# Altium project IMX385_Final.PrjPcb
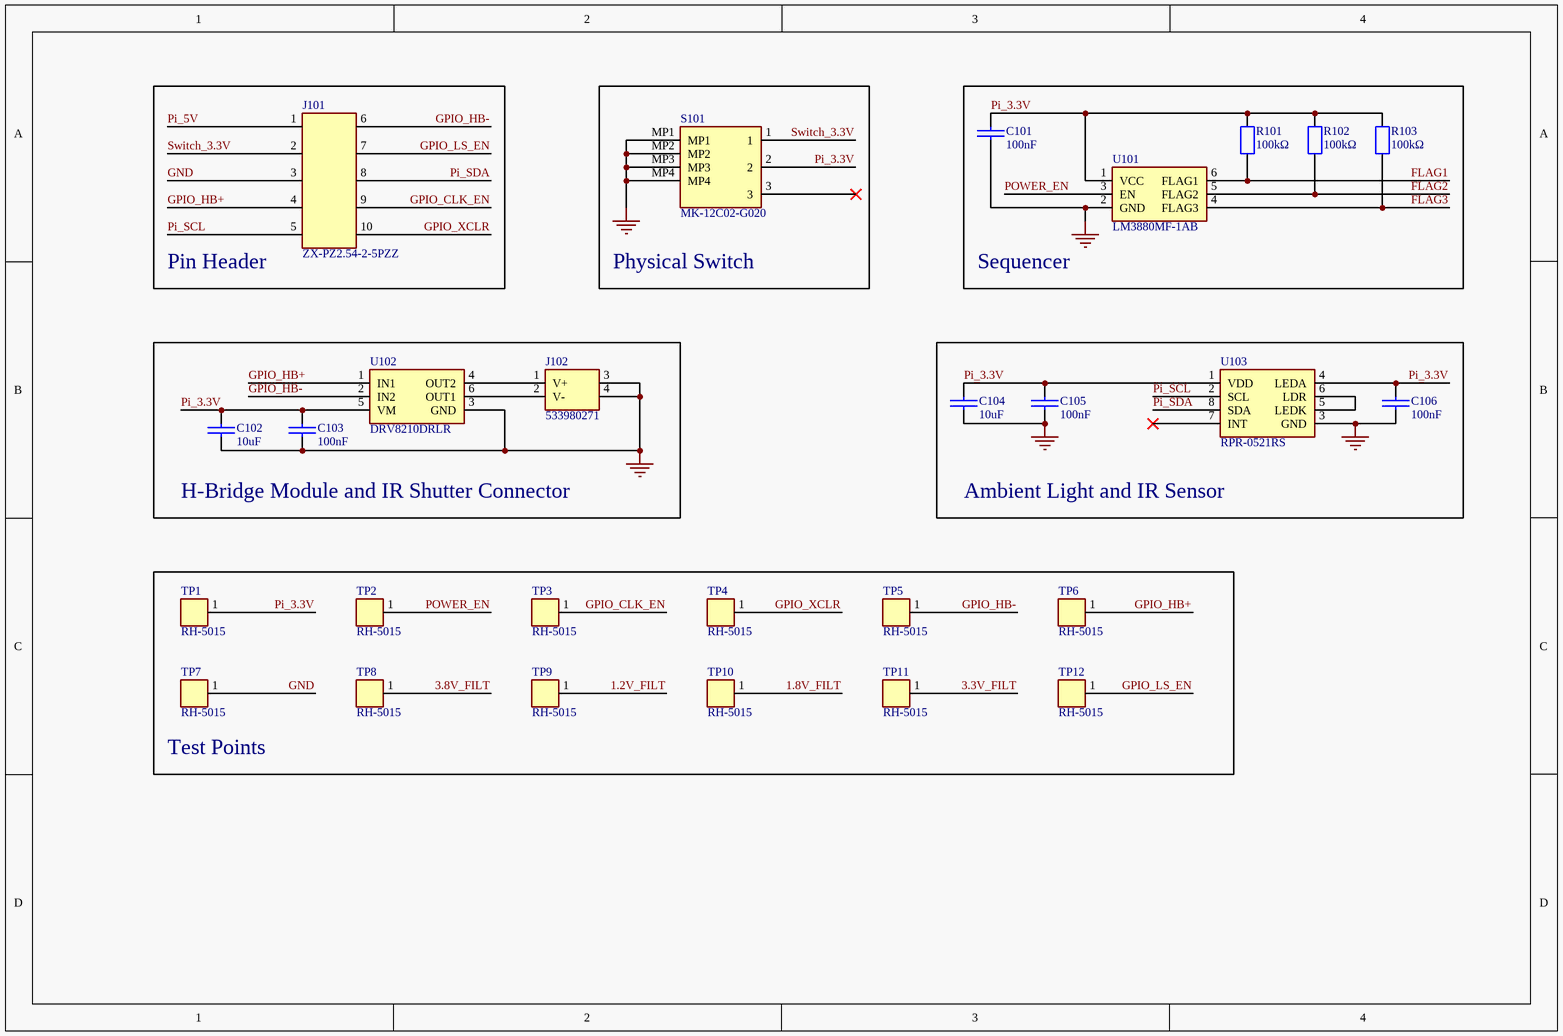
[diagram p0: IMX_Supporting Circuits.SchDoc]
8 sheets, 125 parts. Net scope: global (net labels, ports and power ports of the same name join across sheets).
Board file: IMX_PCB.PcbDoc
Sheets:
  IMX_Supporting Circuits.SchDoc
  IMX_Power Regulation.SchDoc
  IMX_1.2V Digital Power Supply.SchDoc
  IMX_1.8 V Interface Power Supply.SchDoc
  IMX_3.3 V Analog Power Supply.SchDoc
  IMX_Digital Interface Circuit.SchDoc
  IMX_Analog Interface Circuit.SchDoc
  IMX_Output Circuit.SchDoc

## Sheet IMX_Supporting Circuits.SchDoc
size A4; SheetNumber: 1; SheetTotal: 8

### Parts
C101  100nF  [Capacitor, 0402]
C102  10uF  [Capacitor, 0603]
C103  100nF  [Capacitor, 0402]
C104  10uF  [Capacitor, 0603]
C105  100nF  [Capacitor, 0402]
C106  100nF  [Capacitor, 0402]
J101  ZX-PZ2.54-2-5PZZ  [Pin Header, DIP 2x5, 2.54mm]
J102  533980271  [Molex PicoBlade, Wire To Board 1x2, 533980271]
R101  100kΩ  [Resistor, 0603, Yageo]
R102  100kΩ  [Resistor, 0603, Yageo]
R103  100kΩ  [Resistor, 0603, Yageo]
S101  MK-12C02-G020  [Swich, 1A, Single Pole Double Throw, MK-12C02-G020]
TP1  RH-5015  [Test Point]
TP2  RH-5015  [Test Point]
TP3  RH-5015  [Test Point]
TP4  RH-5015  [Test Point]
TP5  RH-5015  [Test Point]
TP6  RH-5015  [Test Point]
TP7  RH-5015  [Test Point]
TP8  RH-5015  [Test Point]
TP9  RH-5015  [Test Point]
TP10  RH-5015  [Test Point]
TP11  RH-5015  [Test Point]
TP12  RH-5015  [Test Point]
U101  LM3880MF-1AB  [Sequencer, SOT-23]
U102  DRV8210DRLR  [H-Bridge, SOT-563]
U103  RPR-0521RS  [Rohm ALS]

### Blocks framed on the sheet
Pin Header: J101
Physical Switch: S101
Sequencer: C101 R101-R103 U101
H-Bridge Module and IR Shutter Connector: C102 C103 J102 U102
Ambient Light and IR Sensor: C104-C106 U103
Test Points: TP1-TP12

### Nets
1.2V_FILT: TP9.1
1.8V_FILT: TP10.1
3.3V_FILT: TP11.1
GND: C101.2 C102.2 C103.2 C104.2 C105.2 C106.2 J101.3 J102.3 J102.4 S101.MP1 S101.MP2 S101.MP3 S101.MP4 TP7.1 U101.2(GND) U102.3(GND) U103.3(GND)
3.8V_FILT: TP8.1
FLAG1: R101.1 U101.6(FLAG1)
FLAG2: R102.1 U101.5(FLAG2)
FLAG3: R103.1 U101.4(FLAG3)
GPIO_CLK_EN: J101.9 TP3.1
GPIO_HB+: J101.4 TP6.1 U102.1(IN1)
GPIO_HB-: J101.6 TP5.1 U102.2(IN2)
GPIO_LS_EN: J101.7 TP12.1
GPIO_XCLR: J101.10 TP4.1
Pi_3.3V: C101.1 C102.1 C103.1 C104.1 C105.1 C106.1 R101.2 R102.2 R103.2 S101.2 TP1.1 U101.1(VCC) U102.5(VM) U103.1(VDD) U103.4(LEDA)
Pi_5V: J101.1
Pi_SCL: J101.5 U103.2(SCL)
Pi_SDA: J101.8 U103.8(SDA)
POWER_EN: TP2.1 U101.3(EN)
Switch_3.3V: J101.2 S101.1
NetJ102_1: J102.1(V+) U102.4(OUT2)
NetJ102_2: J102.2(V-) U102.6(OUT1)
NetU103_5: U103.5(LEDK) U103.6(LDR)

Not connected (* = marked no-connect by the designer): S101 3*; U103 7(INT)*

### Library data of the parts
C101 C103 C105 C106 = Capacitor, 0402, 100nF: Ceramic Capacitor, 16V, 10% +/- Tol, X7R, 0.1uF, SMD, 0402, #CL05B104KO5NNNC, JLC#C1525; Capacitance: 100nF
C102 C104 = Capacitor, 0603, 10uF: Ceramic Capacitor, 10V, 10% +/- Tol, X7R, 10uF, SMD, 0603, #GRM188Z71A106KA73D, JLC#C2959727; Capacitance: 10uF
J101 = Pin Header, DIP 2x5, 2.54mm: Gold 1kV 3A Direct Insert Policy 2.5mm 10P 6mm -40℃~+105℃ 3mm 2.54mm Brass Double Row Black 2.54mm 2x5P Plugin,P=2.54mm Pin Headers ROHS. #ZX-PZ2.54-2-5PZZ, #C7501276
J102 = Molex PicoBlade, Wire To Board 1x2: 1x2P 2P PicoBlade(MX 1.25) Tin 2 -40℃~+105℃ 1A 1 1.25mm Phosphor Bronze Standing paste SMD,P=1.25mm Wire To Board Connector ROHS, #533980271, JLC#C122410
R101-R103 = Resistor, 0603, 100kΩ: Thick Film Resistor, ±1%, ±100ppm/℃, -55℃~+155℃, 0603, 100kΩ, #RC0603FR-07100KL, JLC#C14675
S101 = Swich, 1A, Single Pole Double Throw: Horizontal attachment 1A Single Pole Double Throw (SPDT) 6V Black 10,000 times SMD Slide Switches ROHS, JLC#C963206
TP1-TP12 = Test Ring: Pogo Pin Spring Probe Connector ROHS, #RH-5015, JLC#C5199798
U101 = Sequencer, 3 Flags, 30ms, 1-2-3/3-2-1: USON-6-EP(2.1x2.1) Ambient Light Sensors ROHS, JLC#C701867; Manufacturer_Name: Texas Instruments; Manufacturer_Part_Number: LM3880MF-1AB/NOPB; Datasheet Link: http://www.ti.com/lit/gpn/lm3880; Height: 1.45mm; Mouser Part Number: 926-LM3880MF1ABNOPB; Mouser Price/Stock: https://www.mouser.co.uk/ProductDetail/Texas-Instruments/LM3880MF-1AB-NOPB?qs=QbsRYf82W3EUDzy5l%252BzEeQ%3D%3D; Arrow Part Number: LM3880MF-1AB/NOPB; Arrow Price/Stock: https://www.arrow.com/en/products/lm3880mf-1abnopb/texas-instruments?region=nac
U102 = H-Bridge, SOT-563: SOT-563 Relay / Coil Drivers ROHS, #DRV8210DRLR, JLC#C3681297
U103 = Rohm ALS: SMD-8P Ambient Light Sensors ROHS, JLC#C509781

## Sheet IMX_Power Regulation.SchDoc
size A4; SheetNumber: 2; SheetTotal: 8
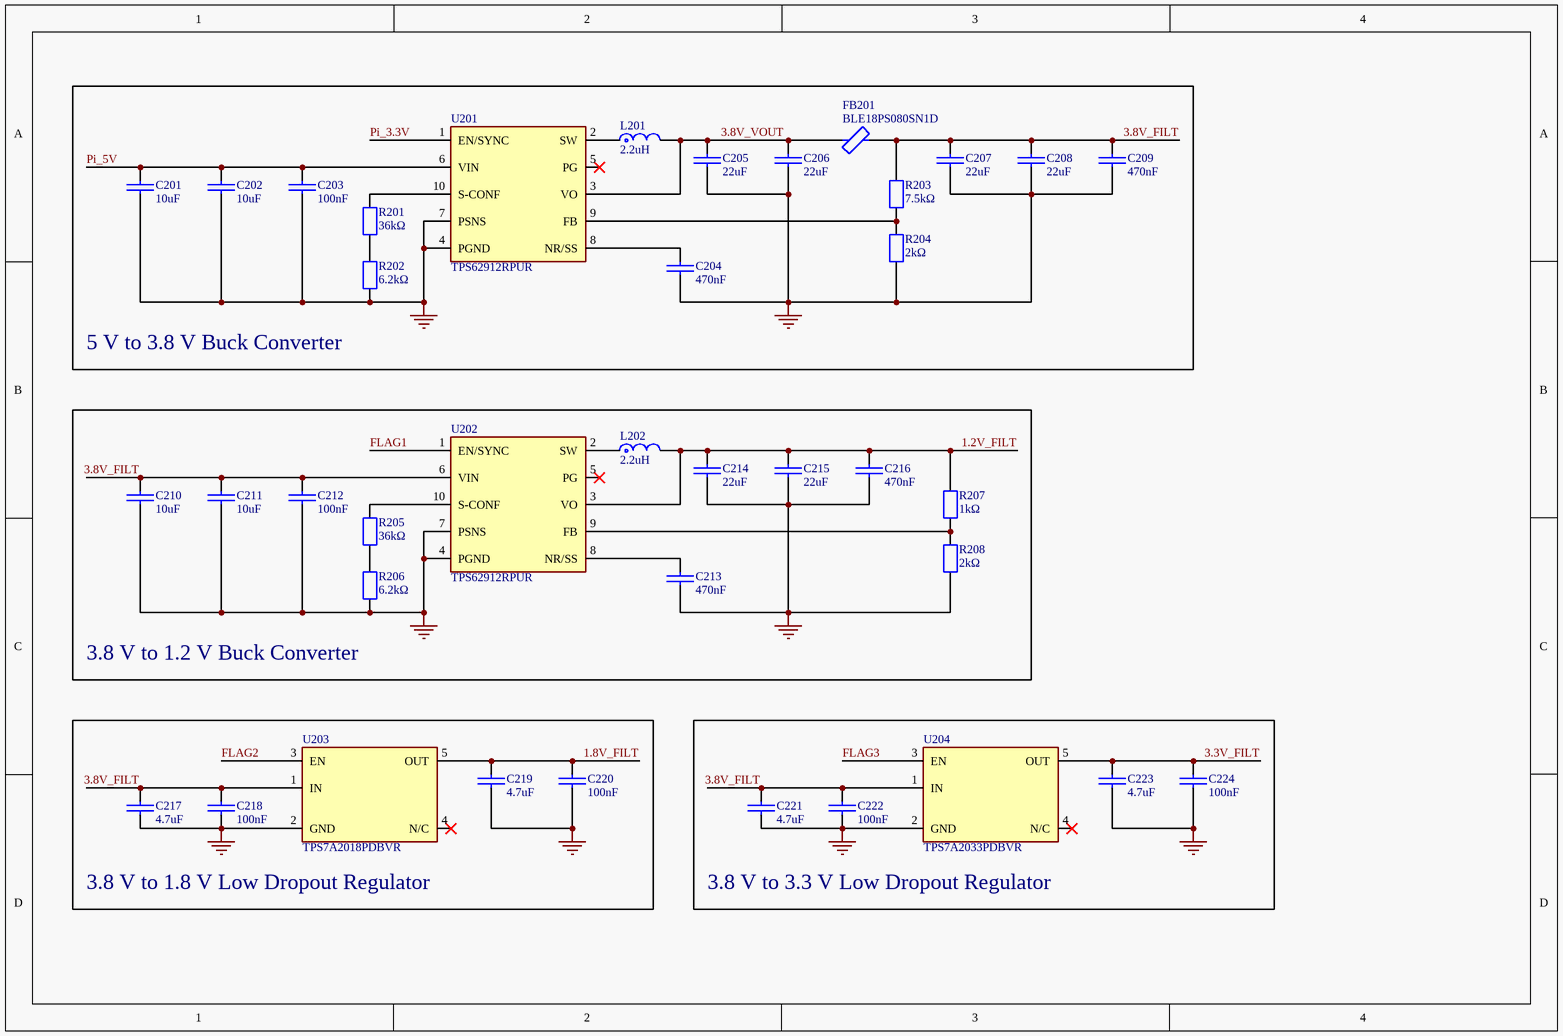
[diagram p1: IMX_Power Regulation.SchDoc]

### Parts
C201  10uF  [Capacitor, 0603]
C202  10uF  [Capacitor, 0603]
C203  100nF  [Capacitor, 0402]
C204  470nF  [Capacitor, 0402]
C205  22uF  [Capacitor, 0805]
C206  22uF  [Capacitor, 0805]
C207  22uF  [Capacitor, 0805]
C208  22uF  [Capacitor, 0805]
C209  470nF  [Capacitor, 0402]
C210  10uF  [Capacitor, 0603]
C211  10uF  [Capacitor, 0603]
C212  100nF  [Capacitor, 0402]
C213  470nF  [Capacitor, 0402]
C214  22uF  [Capacitor, 0805]
C215  22uF  [Capacitor, 0805]
C216  470nF  [Capacitor, 0402]
C217  4.7uF  [Capacitor, 0603]
C218  100nF  [Capacitor, 0402]
C219  4.7uF  [Capacitor, 0603]
C220  100nF  [Capacitor, 0402]
C221  4.7uF  [Capacitor, 0603]
C222  100nF  [Capacitor, 0402]
C223  4.7uF  [Capacitor, 0603]
C224  100nF  [Capacitor, 0402]
FB201  BLE18PS080SN1D  [Ferrite Bead, 0603]
L201  2.2uH  [Inductor, 1616]
L202  2.2uH  [Inductor, 1616]
R201  36kΩ  [Resistor, 0603, Yageo]
R202  6.2kΩ  [Resistor, 0603, Yageo]
R203  7.5kΩ  [Resistor, 0603, Yageo]
R204  2kΩ  [Resistor, 0603, Yageo]
R205  36kΩ  [Resistor, 0603, Yageo]
R206  6.2kΩ  [Resistor, 0603, Yageo]
R207  1kΩ  [Resistor, 0603, Yageo]
R208  2kΩ  [Resistor, 0603, Yageo]
U201  TPS62912RPUR  [Buck Converter, TPS62912RPUR]
U202  TPS62912RPUR  [Buck Converter, TPS62912RPUR]
U203  TPS7A2018PDBVR  [TPS7A20 - SOT-23-5L]
U204  TPS7A2033PDBVR  [TPS7A20 - SOT-23-5L]

### Blocks framed on the sheet
5 V to 3.8 V Buck Converter: C201-C209 FB201 L201 R201-R204 U201
3.8 V to 1.2 V Buck Converter: C210-C216 L202 R205-R208 U202
3.8 V to 1.8 V Low Dropout Regulator: C217-C220 U203
3.8 V to 3.3 V Low Dropout Regulator: C221-C224 U204

### Nets
1.2V_FILT: C214.1 C215.1 C216.1 L202.2 R207.2 U202.3(VO)
1.8V_FILT: C219.1 C220.1 U203.5(OUT)
3.3V_FILT: C223.1 C224.1 U204.5(OUT)
GND: C201.2 C202.2 C203.2 C204.2 C205.2 C206.2 C207.2 C208.2 C209.2 C210.2 C211.2 C212.2 C213.2 C214.2 C215.2 C216.2 C217.2 C218.2 C219.2 C220.2 C221.2 C222.2 C223.2 C224.2 R202.1 R204.1 R206.1 R208.1 U201.4(PGND) U201.7(PSNS) U202.4(PGND) U202.7(PSNS) U203.2(GND) U204.2(GND)
3.8V_FILT: C207.1 C208.1 C209.1 C210.1 C211.1 C212.1 C217.1 C218.1 C221.1 C222.1 FB201.2 R203.2 U202.6(VIN) U203.1(IN) U204.1(IN)
3.8V_VOUT: C205.1 C206.1 FB201.1 L201.2 U201.3(VO)
FLAG1: U202.1(EN/SYNC)
FLAG2: U203.3(EN)
FLAG3: U204.3(EN)
Pi_3.3V: U201.1(EN/SYNC)
Pi_5V: C201.1 C202.1 C203.1 U201.6(VIN)
NetC204_1: C204.1 U201.8(NR/SS)
NetC213_1: C213.1 U202.8(NR/SS)
NetL201_1: L201.1 U201.2(SW)
NetL202_1: L202.1 U202.2(SW)
NetR201_1: R201.1 R202.2
NetR201_2: R201.2 U201.10(S-CONF)
NetR203_1: R203.1 R204.2 U201.9(FB)
NetR205_1: R205.1 R206.2
NetR205_2: R205.2 U202.10(S-CONF)
NetR207_1: R207.1 R208.2 U202.9(FB)

Not connected (* = marked no-connect by the designer): U201 5(PG)*; U202 5(PG)*; U203 4(N/C)*; U204 4(N/C)*

### Library data of the parts
C201 C202 C210 C211 = Capacitor, 0603, 10uF: as C102 on sheet IMX_Supporting Circuits; Capacitance: 10uF
C203 C212 C218 C220 C222 C224 = Capacitor, 0402, 100nF: as C101 on sheet IMX_Supporting Circuits; Capacitance: 100nF
C204 C209 C213 C216 = Capacitor, 0402, 470nF: 16V 470nF X7R ±10% 0402 Multilayer Ceramic Capacitors MLCC - SMD/SMT ROHS, #GRM155R71C474KE01D, JLC#C471404; Capacitance: 470nF
C205-C208 C214 C215 = Capacitor, 0805, 22uF, X5R: 16V 22uF X5R ±10% 0805 Multilayer Ceramic Capacitors MLCC - SMD/SMT ROHS, #CL21A226KOQNNNE, JLC#C296720; Capacitance: 22uF
C217 C219 C221 C223 = Capacitor, 0603, 4.7uF: Ceramic Capacitor, 10V, 10% +/- Tol, X7R, 4.7uF, SMD, 0603, #GRM188Z71A475KE15D, JLC#C913474; Capacitance: 4.7uF
FB201 = Ferrite Bead, 0603, 4mΩ 8.5Ω@100MHz: 4mΩ 8.5Ω@100MHz 0603 Ferrite Beads ROHS, #BLE18PS080SN1D, JLC#C3764407
L201 L202 = Inductor, 1616, 2.2uH: 2.2uH ±20% 7A 1616 Power Inductors ROHS, #XGL4030-222MEC, JLC#C6616463; Core Material: Composite; Test Frequency: 100kHz; Shielding: Shielded; Self Resonant Frequency: 89MHz; Saturation Current: 3.5A; Max DC Current: 11.2A; DC Resistance (DCR): 8.36mR; RMS Current (Irms): 7A; Case/Package: SMD/SMT; Inductance: 2.2uH; Min Operating Temperature: -40°C; Tolerance: 20%; Inductance Tolerance: 20%; Height: 1.6mm; REACH SVHC: No SVHC; Series: XFL4015; Lead Free: Contains Lead; Termination: SMD/SMT; Mount: Surface Mount; Package Quantity: 40; Width: 4.3mm; Packaging: Tape and Reel; Max Operating Temperature: 125°C; Length: 4.3mm; RoHS Compliant: Yes
R201 R205 = Resistor, 0603, 36kΩ: 100mW Thick Film Resistors 75V ±100ppm/℃ ±1% 36kΩ 0603 Chip Resistor - Surface Mount ROHS, #RC0603FR-0736KL, JLC#C114619
R202 R206 = Resistor, 0603, 6.2kΩ: 100mW Thick Film Resistors 75V ±100ppm/℃ ±1% 6.2kΩ 0603 Chip Resistor - Surface Mount ROHS, #RC0603FR-076K2L, JLC#C114631
R203 = Resistor, 0603, 7.5kΩ: 100mW Thick Film Resistors 75V ±100ppm/℃ ±1% 7.5kΩ 0603 Chip Resistor - Surface Mount ROHS, #RC0603FR-077K5L, JLC#C114634
R204 R208 = Resistor, 0603, 2kΩ: 100mW Thick Film Resistors 75V ±100ppm/℃ ±1% 2kΩ 0603 Chip Resistor - Surface Mount ROHS, #RC0603FR-072KL, JLC#C105576
R207 = Resistor, 0603, 1kΩ: Thick Film Resistor, ±1%, ±100ppm/℃, -55℃~+155℃, 0603 Chip Resistor - Surface Mount ROHS, #RC0603FR-071KL, JLC#C22548
U201 U202 = Buck Converter, TPS62912RPUR: Step-down type Adjustable 2A 800mV~5.5V 3V~17V VQFN-10-HR(2x2) DC-DC Converters ROHS, JLC#C3198056; Manufacturer_Name: Texas Instruments; Datasheet Link: https://www.ti.com/lit/gpn/TPS62912; Height: 1mm; Manufacturer_Part_Number: TPS62912RPUR; Mouser Part Number: 595-TPS62912RPUR; Mouser Price/Stock: https://www.mouser.co.uk/ProductDetail/Texas-Instruments/TPS62912RPUR?qs=DRkmTr78QAT3V6egI4ak1w%3D%3D; Arrow Part Number: TPS62912RPUR; Arrow Price/Stock: https://www.arrow.com/en/products/tps62912rpur/texas-instruments?utm_currency=USD&region=europe
U203 = TPS7A2018PDBVR, 1.8V: 300mA Fixed 1.8V Positive electrode 6V SOT-23-5L Voltage Regulators - Linear, Low Drop Out (LDO) Regulators ROHS, JLC#C963430
U204 = TPS7A2018PDBVR, 3.3V: 300mA Fixed 3.3V Positive electrode 6V SOT-23-5 Voltage Regulators - Linear, Low Drop Out (LDO) Regulators ROHS, JLC#C2862740

## Sheet IMX_1.2V Digital Power Supply.SchDoc
size A4; SheetNumber: 3; SheetTotal: 8
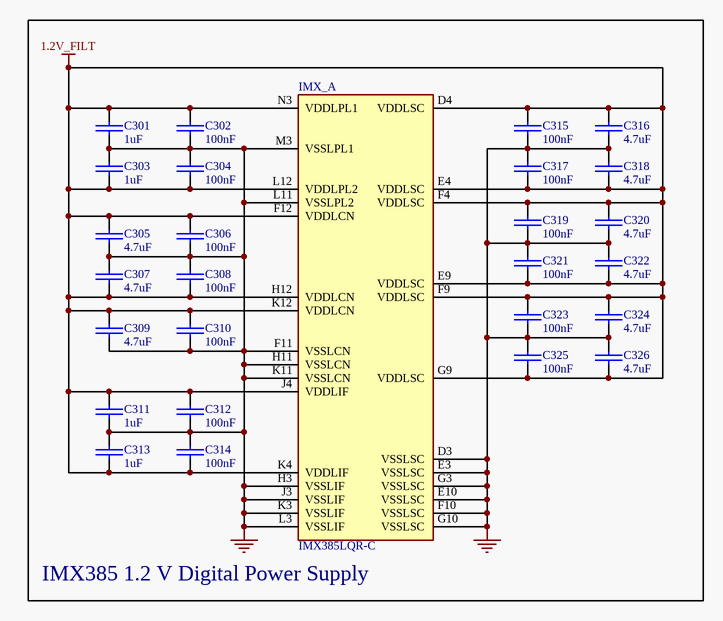
[diagram p2: IMX_1.2V Digital Power Supply.SchDoc]

### Parts
C301  1uF  [Capacitor, 0402]
C302  100nF  [Capacitor, 0402]
C303  1uF  [Capacitor, 0402]
C304  100nF  [Capacitor, 0402]
C305  4.7uF  [Capacitor, 0402]
C306  100nF  [Capacitor, 0402]
C307  4.7uF  [Capacitor, 0402]
C308  100nF  [Capacitor, 0402]
C309  4.7uF  [Capacitor, 0402]
C310  100nF  [Capacitor, 0402]
C311  1uF  [Capacitor, 0402]
C312  100nF  [Capacitor, 0402]
C313  1uF  [Capacitor, 0402]
C314  100nF  [Capacitor, 0402]
C315  100nF  [Capacitor, 0402]
C316  4.7uF  [Capacitor, 0402]
C317  100nF  [Capacitor, 0402]
C318  4.7uF  [Capacitor, 0402]
C319  100nF  [Capacitor, 0402]
C320  4.7uF  [Capacitor, 0402]
C321  100nF  [Capacitor, 0402]
C322  4.7uF  [Capacitor, 0402]
C323  100nF  [Capacitor, 0402]
C324  4.7uF  [Capacitor, 0402]
C325  100nF  [Capacitor, 0402]
C326  4.7uF  [Capacitor, 0402]
IMX_  IMX385LQR-C  [IMX385LQR]  (part A of 6)

### Blocks framed on the sheet
IMX385 1.2 V Digital Power Supply: C301-C326 IMX_

### Nets
1.2V_FILT: C301.1 C302.1 C303.2 C304.2 C305.1 C306.1 C307.2 C308.2 C309.1 C310.1 C311.1 C312.1 C313.2 C314.2 C315.1 C316.1 C317.2 C318.2 C319.1 C320.1 C321.2 C322.2 C323.1 C324.1 C325.2 C326.2 IMX_.D4(VDDLSC) IMX_.E4(VDDLSC) IMX_.E9(VDDLSC) IMX_.F4(VDDLSC) IMX_.F9(VDDLSC) IMX_.F12(VDDLCN) IMX_.G9(VDDLSC) IMX_.H12(VDDLCN) IMX_.J4(VDDLIF) IMX_.K4(VDDLIF) IMX_.K12(VDDLCN) IMX_.L12(VDDLPL2) IMX_.N3(VDDLPL1)
GND: C301.2 C302.2 C303.1 C304.1 C305.2 C306.2 C307.1 C308.1 C309.2 C310.2 C311.2 C312.2 C313.1 C314.1 C315.2 C316.2 C317.1 C318.1 C319.2 C320.2 C321.1 C322.1 C323.2 C324.2 C325.1 C326.1 IMX_.D3(VSSLSC) IMX_.E3(VSSLSC) IMX_.E10(VSSLSC) IMX_.F10(VSSLSC) IMX_.F11(VSSLCN) IMX_.G3(VSSLSC) IMX_.G10(VSSLSC) IMX_.H3(VSSLIF) IMX_.H11(VSSLCN) IMX_.J3(VSSLIF) IMX_.K3(VSSLIF) IMX_.K11(VSSLCN) IMX_.L3(VSSLIF) IMX_.L11(VSSLPL2) IMX_.M3(VSSLPL1)

### Library data of the parts
C301 C303 C311 C313 = Capacitor, 0402, 1uF: Ceramic Capacitor, 10V, 10% +/- Tol, X7R, 1uF, SMD, 0402, #GRM155Z71A105KE01D, JLC#C528974; Capacitance: 1uF
C302 C304 C306 C308 C310 C312 C314 C315 C317 C319 C321 C323 C325 = Capacitor, 0402, 100nF: as C101 on sheet IMX_Supporting Circuits; Capacitance: 100nF
C305 C307 C309 C316 C318 C320 C322 C324 C326 = Capacitor, 0402, 4.7uF: Ceramic Capacitor, 10V, 10% +/- Tol, X5R, 4.7uF, SMD, 0402, #CL05A475KP5NRNC, JLC#C368809; Capacitance: 4.7uF
IMX_ = IMX385LQR

## Sheet IMX_1.8 V Interface Power Supply.SchDoc
size A4; SheetNumber: 4; SheetTotal: 8
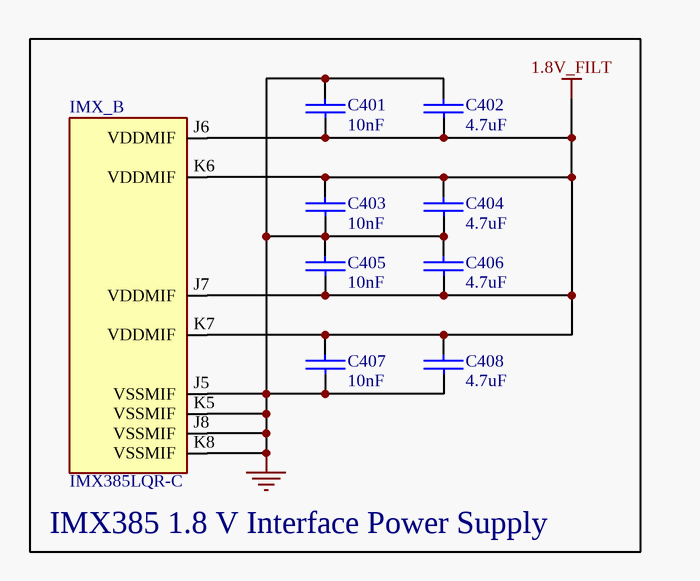
[diagram p3: IMX_1.8 V Interface Power Supply.SchDoc]

### Parts
C401  10nF  [Capacitor, 0402]
C402  4.7uF  [Capacitor, 0402]
C403  10nF  [Capacitor, 0402]
C404  4.7uF  [Capacitor, 0402]
C405  10nF  [Capacitor, 0402]
C406  4.7uF  [Capacitor, 0402]
C407  10nF  [Capacitor, 0402]
C408  4.7uF  [Capacitor, 0402]
IMX_  IMX385LQR-C  [IMX385LQR]  (part B of 6)

### Blocks framed on the sheet
IMX385 1.8 V Interface Power Supply: C401-C408 IMX_

### Nets
1.8V_FILT: C401.2 C402.2 C403.1 C404.1 C405.2 C406.2 C407.1 C408.1 IMX_.J6(VDDMIF) IMX_.J7(VDDMIF) IMX_.K6(VDDMIF) IMX_.K7(VDDMIF)
GND: C401.1 C402.1 C403.2 C404.2 C405.1 C406.1 C407.2 C408.2 IMX_.J5(VSSMIF) IMX_.J8(VSSMIF) IMX_.K5(VSSMIF) IMX_.K8(VSSMIF)

### Library data of the parts
C401 C403 C405 C407 = Capacitor, 0402, 10nF: Ceramic Capacitor, 16V, 10% +/- Tol, X7R, 10nF, SMD, 0402, #CL05B103KO5NNNC, JLC#C318577; Capacitance: 10nF
C402 C404 C406 C408 = Capacitor, 0402, 4.7uF: as C305 on sheet IMX_1.2V Digital Power Supply; Capacitance: 4.7uF
IMX_ = IMX385LQR

## Sheet IMX_3.3 V Analog Power Supply.SchDoc
size A4; SheetNumber: 5; SheetTotal: 8
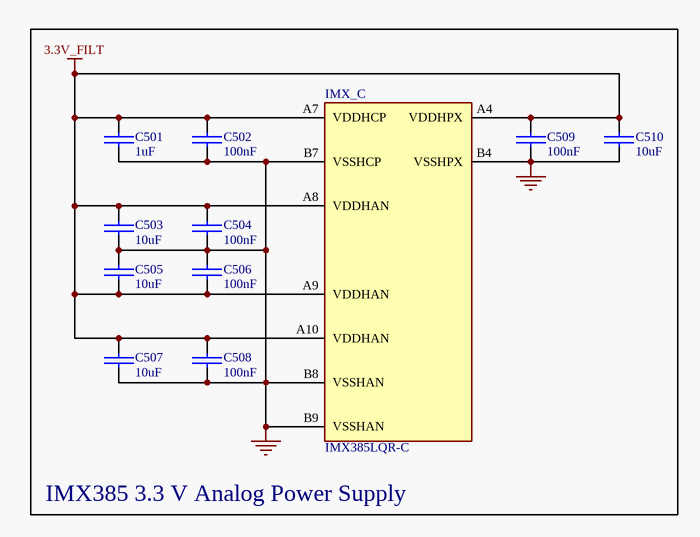
[diagram p4: IMX_3.3 V Analog Power Supply.SchDoc]

### Parts
C501  1uF  [Capacitor, 0402]
C502  100nF  [Capacitor, 0402]
C503  10uF  [Capacitor, 0603]
C504  100nF  [Capacitor, 0402]
C505  10uF  [Capacitor, 0603]
C506  100nF  [Capacitor, 0402]
C507  10uF  [Capacitor, 0603]
C508  100nF  [Capacitor, 0402]
C509  100nF  [Capacitor, 0402]
C510  10uF  [Capacitor, 0603]
IMX_  IMX385LQR-C  [IMX385LQR]  (part C of 6)

### Blocks framed on the sheet
IMX385 3.3 V Analog Power Supply: C501-C510 IMX_

### Nets
3.3V_FILT: C501.1 C502.1 C503.1 C504.1 C505.2 C506.2 C507.1 C508.1 C509.1 C510.1 IMX_.A4(VDDHPX) IMX_.A7(VDDHCP) IMX_.A8(VDDHAN) IMX_.A9(VDDHAN) IMX_.A10(VDDHAN)
GND: C501.2 C502.2 C503.2 C504.2 C505.1 C506.1 C507.2 C508.2 C509.2 C510.2 IMX_.B4(VSSHPX) IMX_.B7(VSSHCP) IMX_.B8(VSSHAN) IMX_.B9(VSSHAN)

### Library data of the parts
C501 = Capacitor, 0402, 1uF: as C301 on sheet IMX_1.2V Digital Power Supply; Capacitance: 1uF
C502 C504 C506 C508 C509 = Capacitor, 0402, 100nF: as C101 on sheet IMX_Supporting Circuits; Capacitance: 100nF
C503 C505 C507 C510 = Capacitor, 0603, 10uF: as C102 on sheet IMX_Supporting Circuits; Capacitance: 10uF
IMX_ = IMX385LQR

## Sheet IMX_Digital Interface Circuit.SchDoc
size A4; SheetNumber: 6; SheetTotal: 8
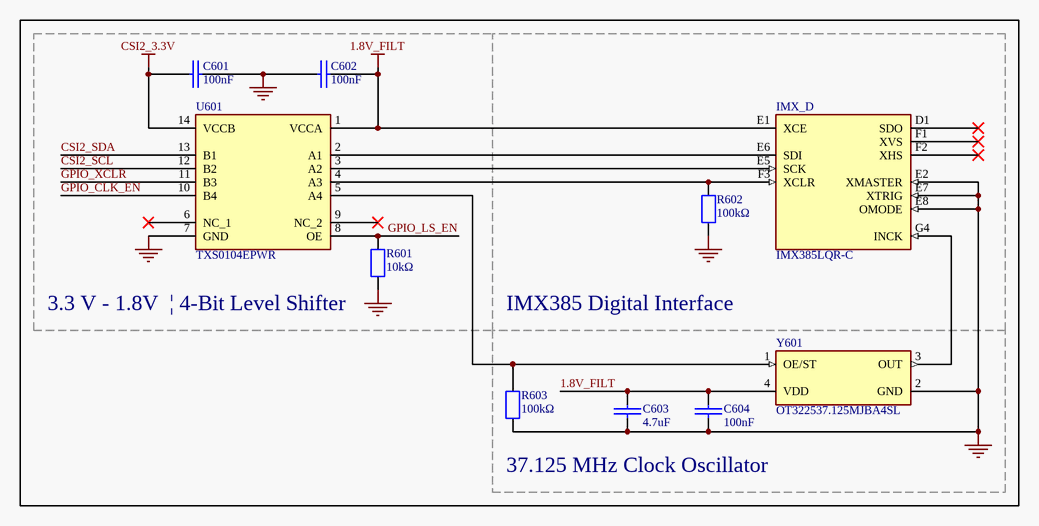
[diagram p5: IMX_Digital Interface Circuit.SchDoc]

### Parts
C601  100nF  [Capacitor, 0402]
C602  100nF  [Capacitor, 0402]
C603  4.7uF  [Capacitor, 0603]
C604  100nF  [Capacitor, 0402]
IMX_  IMX385LQR-C  [IMX385LQR]  (part D of 6)
R601  10kΩ  [Resistor, 0603, Yageo]
R602  100kΩ  [Resistor, 0603, Yageo]
R603  100kΩ  [Resistor, 0603, Yageo]
U601  TXS0104EPWR  [Level Shifter, 4-Bit]
Y601  OT322537.125MJBA4SL  [Clock Oscillator, 3235, 37.125]

### Nets
1.8V_FILT: C602.2 C603.1 C604.1 IMX_.E1(XCE) U601.1(VCCA) Y601.4(VDD)
CSI2_3.3V: C601.2 U601.14(VCCB)
GND: C601.1 C602.1 C603.2 C604.2 IMX_.E2(XMASTER) IMX_.E7(XTRIG) IMX_.E8(OMODE) R601.1 R602.1 R603.1 U601.7(GND) Y601.2(GND)
CSI2_SCL: U601.12(B2)
CSI2_SDA: U601.13(B1)
GPIO_CLK_EN: U601.10(B4)
GPIO_LS_EN: R601.2 U601.8(OE)
GPIO_XCLR: U601.11(B3)
NetIMX__E5: IMX_.E5(SCK) U601.3(A2)
NetIMX__E6: IMX_.E6(SDI) U601.2(A1)
NetIMX__F3: IMX_.F3(XCLR) R602.2 U601.4(A3)
NetIMX__G4: IMX_.G4(INCK) Y601.3(OUT)
NetR603_2: R603.2 U601.5(A4) Y601.1(OE/ST)

Not connected (* = marked no-connect by the designer): IMX_ D1(SDO)* F1(XVS)* F2(XHS)*; U601 6(NC_1)* 9(NC_2)*

### Notes on the sheet
- (near R601) 3.3 V - 1.8V  | 4-Bit Level Shifter
- IMX385 Digital Interface
- 37.125 MHz Clock Oscillator

### Library data of the parts
C601 C602 C604 = Capacitor, 0402, 100nF: as C101 on sheet IMX_Supporting Circuits; Capacitance: 100nF
C603 = Capacitor, 0603, 4.7uF: as C217 on sheet IMX_Power Regulation; Capacitance: 4.7uF
IMX_ = IMX385LQR
R601 = Resistor, 0603, 10kΩ: Thick Film Resistor, ±1%, ±100ppm/℃, -55℃~+155℃, 0603, 10kΩ, #RC0603FR-0710KL, JLC#C98220
R602 R603 = Resistor, 0603, 100kΩ: as R101 on sheet IMX_Supporting Circuits
U601 = Level Shifter 4-Bit, Open Drain: 2.3V~5.5V 1 4 1.65V~3.6V 24Mbps TSSOP-14 Translators, Level Shifters ROHS, #TXS0104EPWR, JLC#C44955
Y601 = Clock Oscillator, SMD3225, 37.125Mhz: 1.8V~3.3V ±10ppm ±20ppm CMOS 37.125MHz SMD3225-4P Crystal Oscillators ROHS, JLC#C2831393

## Sheet IMX_Analog Interface Circuit.SchDoc
size A4; SheetNumber: 7; SheetTotal: 8
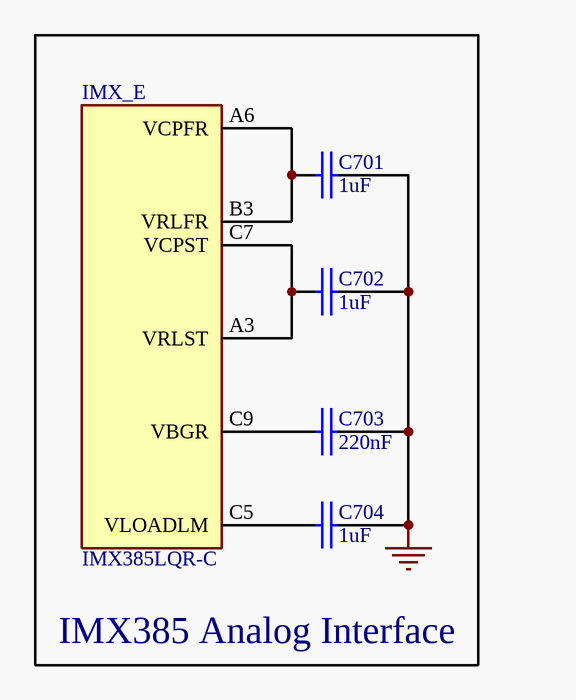
[diagram p6: IMX_Analog Interface Circuit.SchDoc]

### Parts
C701  1uF  [Capacitor, 0402]
C702  1uF  [Capacitor, 0402]
C703  220nF  [Capacitor, 0402]
C704  1uF  [Capacitor, 0402]
IMX_  IMX385LQR-C  [IMX385LQR]  (part E of 6)

### Blocks framed on the sheet
IMX385 Analog Interface: C701-C704 IMX_

### Nets
GND: C701.1 C702.1 C703.1 C704.2
NetC701_2: C701.2 IMX_.A6(VCPFR) IMX_.B3(VRLFR)
NetC702_2: C702.2 IMX_.A3(VRLST) IMX_.C7(VCPST)
NetC703_2: C703.2 IMX_.C9(VBGR)
NetC704_1: C704.1 IMX_.C5(VLOADLM)

### Library data of the parts
C701 C702 C704 = Capacitor, 0402, 1uF: as C301 on sheet IMX_1.2V Digital Power Supply; Capacitance: 1uF
C703 = Capacitor, 0402, 220nF: Ceramic Capacitor, 16V, 10% +/- Tol, X7R, 220nF, SMD, 0402, #CL05B224KO5NNNC, JLC#C16772; Capacitance: 220nF
IMX_ = IMX385LQR

## Sheet IMX_Output Circuit.SchDoc
size A4; SheetNumber: 8; SheetTotal: 8
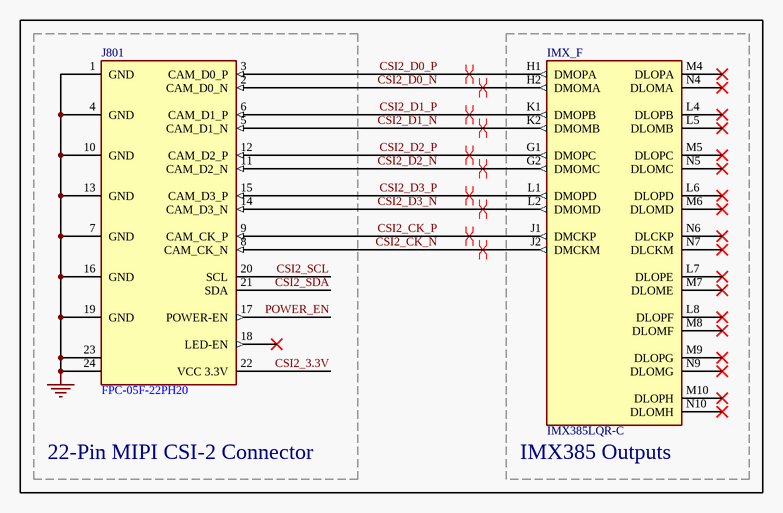
[diagram p7: IMX_Output Circuit.SchDoc]

### Parts
IMX_  IMX385LQR-C  [IMX385LQR]  (part F of 6)
J801  FPC-05F-22PH20  [FFC Connector]

### Blocks framed on the sheet
22-Pin MIPI CSI-2 Connector: J801
IMX385 Outputs: IMX_

### Nets
CSI2_3.3V: J801.22(VCC_3.3V)
GND: J801.1(GND) J801.4(GND) J801.7(GND) J801.10(GND) J801.13(GND) J801.16(GND) J801.19(GND) J801.23 J801.24
CSI2_CK_N: IMX_.J2(DMCKM) J801.8(CAM_CK_N)
CSI2_CK_P: IMX_.J1(DMCKP) J801.9(CAM_CK_P)
CSI2_D0_N: IMX_.H2(DMOMA) J801.2(CAM_D0_N)
CSI2_D0_P: IMX_.H1(DMOPA) J801.3(CAM_D0_P)
CSI2_D1_N: IMX_.K2(DMOMB) J801.5(CAM_D1_N)
CSI2_D1_P: IMX_.K1(DMOPB) J801.6(CAM_D1_P)
CSI2_D2_N: IMX_.G2(DMOMC) J801.11(CAM_D2_N)
CSI2_D2_P: IMX_.G1(DMOPC) J801.12(CAM_D2_P)
CSI2_D3_N: IMX_.L2(DMOMD) J801.14(CAM_D3_N)
CSI2_D3_P: IMX_.L1(DMOPD) J801.15(CAM_D3_P)
CSI2_SCL: J801.20(SCL)
CSI2_SDA: J801.21(SDA)
POWER_EN: J801.17(POWER-EN)

Not connected (* = marked no-connect by the designer): IMX_ L4(DLOPB)* L5(DLOMB)* L6(DLOPD)* L7(DLOPE)* L8(DLOPF)* M4(DLOPA)* M5(DLOPC)* M6(DLOMD)* M7(DLOME)* M8(DLOMF)* M9(DLOPG)* M10(DLOPH)* N4(DLOMA)* N5(DLOMC)* N6(DLCKP)* N7(DLCKM)* N9(DLOMG)* N10(DLOMH)*; J801 18(LED-EN)*

### Layout directives
differential pair; differential pair class D0: CSI2_D0_N, CSI2_D0_P
differential pair; differential pair class D1: CSI2_D1_N, CSI2_D1_P
differential pair; differential pair class D2: CSI2_D2_N, CSI2_D2_P
differential pair; differential pair class D3: CSI2_D3_N, CSI2_D3_P
differential pair; differential pair class DCK: CSI2_CK_N, CSI2_CK_P

### Library data of the parts
IMX_ = IMX385LQR
J801 = CSI-2 Connector: SMD,P=0.5mm,Surface Mount, Right Angle, #FPC-05F-22PH20, #C2856804

## Nets that join several sheets
1.2V_FILT: IMX_Supporting Circuits (TP9.1), IMX_Power Regulation (6 pins), IMX_1.2V Digital Power Supply (39 pins)
1.8V_FILT: IMX_Supporting Circuits (TP10.1), IMX_Power Regulation (C219.1 C220.1 U203.5), IMX_1.8 V Interface Power Supply (12 pins), IMX_Digital Interface Circuit (6 pins)
3.3V_FILT: IMX_Supporting Circuits (TP11.1), IMX_Power Regulation (C223.1 C224.1 U204.5), IMX_3.3 V Analog Power Supply (15 pins)
CSI2_3.3V: IMX_Digital Interface Circuit (C601.2 U601.14), IMX_Output Circuit (J801.22)
GND: IMX_Supporting Circuits (17 pins), IMX_Power Regulation (34 pins), IMX_1.2V Digital Power Supply (41 pins), IMX_1.8 V Interface Power Supply (12 pins), IMX_3.3 V Analog Power Supply (14 pins), IMX_Digital Interface Circuit (12 pins), IMX_Analog Interface Circuit (C701.1 C702.1 C703.1 C704.2), IMX_Output Circuit (9 pins)
3.8V_FILT: IMX_Supporting Circuits (TP8.1), IMX_Power Regulation (15 pins)
CSI2_SCL: IMX_Digital Interface Circuit (U601.12), IMX_Output Circuit (J801.20)
CSI2_SDA: IMX_Digital Interface Circuit (U601.13), IMX_Output Circuit (J801.21)
FLAG1: IMX_Supporting Circuits (R101.1 U101.6), IMX_Power Regulation (U202.1)
FLAG2: IMX_Supporting Circuits (R102.1 U101.5), IMX_Power Regulation (U203.3)
FLAG3: IMX_Supporting Circuits (R103.1 U101.4), IMX_Power Regulation (U204.3)
GPIO_CLK_EN: IMX_Supporting Circuits (J101.9 TP3.1), IMX_Digital Interface Circuit (U601.10)
GPIO_LS_EN: IMX_Supporting Circuits (J101.7 TP12.1), IMX_Digital Interface Circuit (R601.2 U601.8)
GPIO_XCLR: IMX_Supporting Circuits (J101.10 TP4.1), IMX_Digital Interface Circuit (U601.11)
Pi_3.3V: IMX_Supporting Circuits (15 pins), IMX_Power Regulation (U201.1)
Pi_5V: IMX_Supporting Circuits (J101.1), IMX_Power Regulation (C201.1 C202.1 C203.1 U201.6)
POWER_EN: IMX_Supporting Circuits (TP2.1 U101.3), IMX_Output Circuit (J801.17)